# EAGLE design atecc608a-breakout (EAGLE 9.2.2)
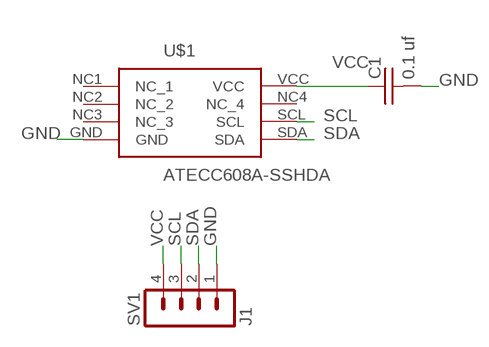
[diagram p0: schematic, sheet 1]

## Parts
C1  0.1 uf  C-USC0805  [C0805]
SV1  J1  MA04-1  [MA04-1]
U$1  ATECC608A-SSHDA  [8-SOIC]

## Nets
GND: C1.2 SV1.1 U$1.GND
SCL: SV1.3 U$1.SCL
SDA: SV1.2 U$1.SDA
VCC: C1.1 SV1.4 U$1.VCC
Unconnected: U$1.NC1(NC_1) U$1.NC2(NC_2) U$1.NC3(NC_3) U$1.NC4(NC_4)

## Library data of the parts
C1 = ATECC608A-SSHDA:C-US: CAPACITOR, American symbol
SV1 = ATECC608A-SSHDA:MA04-1: PIN HEADER; OC_FARNELL: unknown; OC_NEWARK: unknown
U$1 = ATECC608A-SSHDA:ATECC608A-SSHDA

## Board
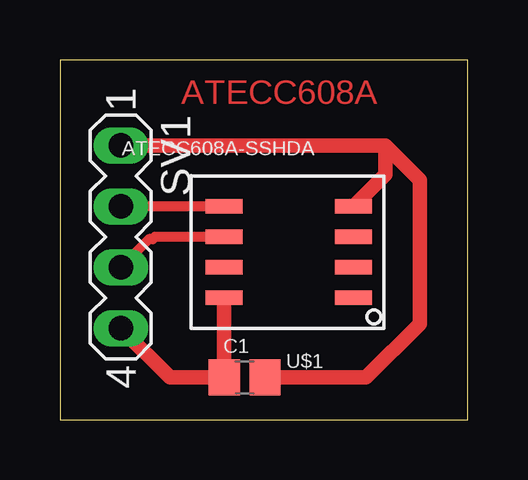
[diagram p1: board, top side]

Size 17 x 15 mm. Coordinates in mm from the lower left corner, seen from the top.
Outline: 0,0 17,0 17,15 0,15 0,0
Copper layers (1*16): Top 0.035mm / dielectric 1.5mm / Bottom 0.035mm
Design rules "OthermillDRC_1_64_v2": minimum track width 16mil, minimum drill 31mil, track to track 0.39878125mm, track to pad 0.39878125mm, pad to pad 0.39878125mm, via to via 0.39878125mm, smd to smd 0mil, copper to edge 0mil, drill to drill 1mil, minimum pad ring 0mil, minimum via ring 15mil, stop-mask expansion 1mil, vias tented up to drill 30mil, thermal gap 10mil

### Footprints (pad centres in the part's own frame; a part is rotated, then mirrored left to right if it is on the bottom)
C0805 = smd 1.3 x 1.5: 1 -0.85,0; 2 0.85,0
MA04-1 = drill 1.016 long: 1 -3.81,0; 2 -1.27,0; 3 1.27,0; 4 3.81,0
8-SOIC = smd 0.6 x 1.55: GND 3.81,0; NC1 0,0; NC2 1.27,0; NC3 2.54,0; NC4 1.27,5.4; SCL 2.54,5.4; SDA 3.81,5.4; VCC 0,5.4

### Placement (x,y rotation side)
C1  7.7,1.76 0 top
SV1  2.54,7.62 270 top
U$1  12.24,5.08 90 top

### Tracks (layer width: path | path; a pad name or v marks a point on that pad's centre or on a via)
GND
  Top 0.61: C1.2 12.76,1.76 15,4 15,10 13.57,11.43 | 13.57,11.43 SV1.1 | U$1.GND 13.57,10.22 13.57,11.43
SCL
  Top 0.406: U$1.SCL 3.96,7.62 3.87,7.53 3.72,7.53 SV1.3
SDA
  Top 0.406: U$1.SDA SV1.2
VCC
  Top 0.406: U$1.VCC
  Top 0.61: SV1.4 4.59,1.76 C1.1 U$1.VCC

### Text on the board
Top: ATECC608A